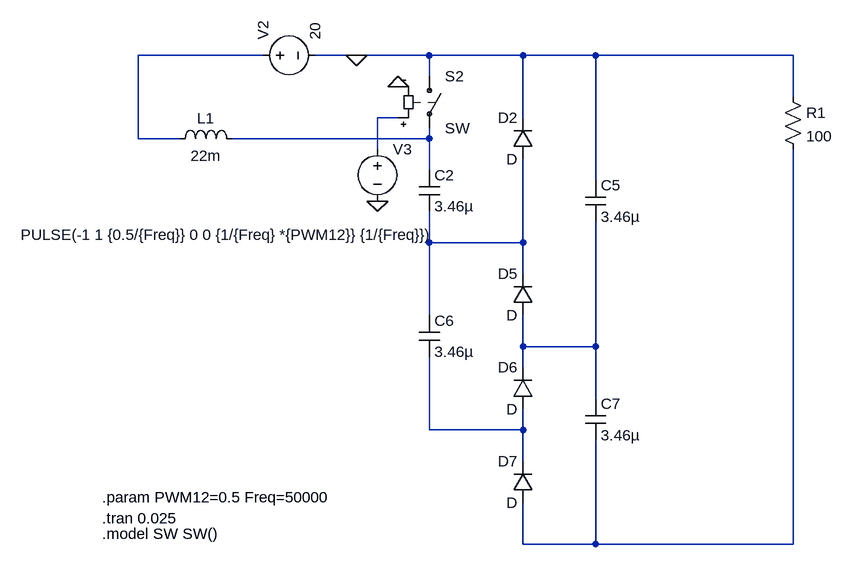
[diagram p0: schematic 1Nxsingleinvert.asc]
1Nxsingleinvert.asc, the LTspice schematic file:
Version 4
SHEET 1 1520 1864
WIRE 192 976 0 976
WIRE 336 976 272 976
WIRE 448 976 336 976
WIRE 592 976 448 976
WIRE 704 976 592 976
WIRE 1008 976 704 976
WIRE 448 1008 448 976
WIRE 1008 1040 1008 976
WIRE 400 1072 368 1072
WIRE 592 1072 592 976
WIRE 0 1104 0 976
WIRE 64 1104 0 1104
WIRE 448 1104 448 1088
WIRE 448 1104 144 1104
WIRE 368 1120 368 1072
WIRE 448 1152 448 1104
WIRE 704 1168 704 976
WIRE 448 1264 448 1216
WIRE 592 1264 592 1136
WIRE 592 1264 448 1264
WIRE 592 1312 592 1264
WIRE 448 1376 448 1264
WIRE 592 1424 592 1376
WIRE 704 1424 704 1232
WIRE 704 1424 592 1424
WIRE 592 1456 592 1424
WIRE 704 1504 704 1424
WIRE 448 1552 448 1440
WIRE 592 1552 592 1520
WIRE 592 1552 448 1552
WIRE 592 1600 592 1552
WIRE 592 1728 592 1664
WIRE 704 1728 704 1568
WIRE 704 1728 592 1728
WIRE 1008 1728 1008 1120
WIRE 1008 1728 704 1728
FLAG 400 1024 0
FLAG 336 976 0
FLAG 368 1200 0
SYMBOL voltage 176 976 R270
WINDOW 123 0 0 Left 2
WINDOW 39 0 0 Left 2
SYMATTR InstName V2
SYMATTR Value 20
SYMBOL sw 448 992 R0
SYMATTR InstName S2
SYMBOL ind 48 1120 R270
WINDOW 0 32 56 VTop 2
WINDOW 3 5 56 VBottom 2
SYMATTR InstName L1
SYMATTR Value 22m
SYMBOL cap 432 1152 R0
SYMATTR InstName C2
SYMATTR Value 3.46µ
SYMBOL cap 688 1168 R0
SYMATTR InstName C5
SYMATTR Value 3.46µ
SYMBOL diode 608 1136 R180
WINDOW 0 24 64 Left 2
WINDOW 3 24 0 Left 2
SYMATTR InstName D2
SYMBOL diode 608 1376 R180
WINDOW 0 24 64 Left 2
WINDOW 3 24 0 Left 2
SYMATTR InstName D5
SYMBOL diode 608 1520 R180
WINDOW 0 24 64 Left 2
WINDOW 3 24 0 Left 2
SYMATTR InstName D6
SYMBOL diode 608 1664 R180
WINDOW 0 24 64 Left 2
WINDOW 3 24 0 Left 2
SYMATTR InstName D7
SYMBOL cap 432 1376 R0
SYMATTR InstName C6
SYMATTR Value 3.46µ
SYMBOL cap 688 1504 R0
SYMATTR InstName C7
SYMATTR Value 3.46µ
SYMBOL res 992 1024 R0
SYMATTR InstName R1
SYMATTR Value 100
SYMBOL voltage 368 1104 R0
WINDOW 3 -549 148 Left 2
WINDOW 123 0 0 Left 2
WINDOW 39 0 0 Left 2
SYMATTR Value PULSE(-1 1 {0.5/{Freq}} 0 0 {1/{Freq} *{PWM12}} {1/{Freq}})
SYMATTR InstName V3
TEXT -56 1688 Left 2 !.tran 0.025
TEXT -56 1712 Left 2 !.model SW SW()
TEXT -56 1656 Left 2 !.param PWM12=0.5 Freq=50000

The netlist it stands for:
* 1Nxsingleinvert.asc
V2 N001 0 20
S2 0 N003 N002 0 SW
L1 N001 N003 22m
C2 N003 N004 3.46µ
C5 0 N005 3.46µ
D2 N004 0 D
D5 N005 N004 D
D6 N006 N005 D
D7 N007 N006 D
C6 N004 N006 3.46µ
C7 N005 N007 3.46µ
R1 0 N007 100
V3 N002 0 PULSE(-1 1 {0.5/{Freq}} 0 0 {1/{Freq} *{PWM12}} {1/{Freq}})
.model D D
.lib standard.dio
.tran 0.025
.model SW SW()
.param PWM12=0.5 Freq=50000
.backanno
.end